# Altium schematic sheet PCB schematic for light switch.SchDoc
size A; SheetNumber: 1; SheetTotal: 1; SPICEModelCacheRGATOCWX: <root> / <DocumentId>RGATOCWX</DocumentId> / <CacheFrame Number="0"> / <Model Name="1n4007" Kind="MDL"> / <Text>*1N4007 MCE 8-16-95 / *1000V 1A Si GenPurpose Diode pkg:DIODE0.4 1,2 / .MODEL 1N4007 D(IS=2.55E-9 RS=0.042 N=1.75 TT=5.76E-6 CJO=1.85E-11 / + VJ=0.75 M=0.333 BV=1000 IBV=9.86E-5 )</Text> / </Model> / </CacheFrame> / </root>
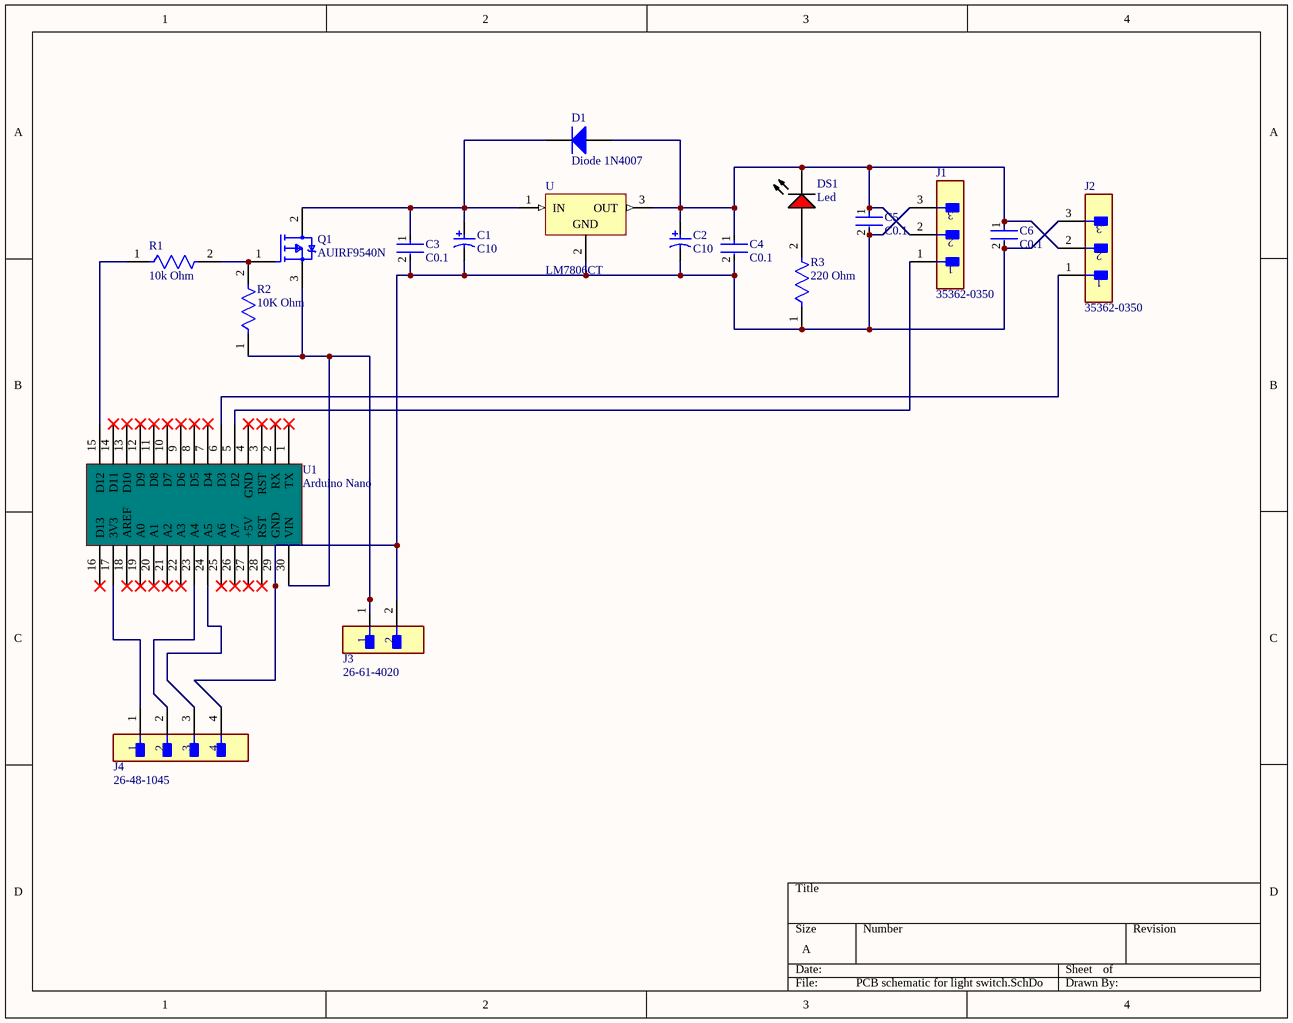
[diagram p0: PCB schematic for light switch.SchDoc]

## Parts
C1  C10  [CAPPR55-200-1100X500X1200]
C2  C10  [CAPPR55-200-1100X500X1200]
C3  C0.1  [FP-K15H5-MFG]
C4  C0.1  [FP-K15H5-MFG]
C5  C0.1  [FP-K15H5-MFG]
C6  C0.1  [FP-K15H5-MFG]
D1  Diode 1N4007  [DO-41]
DS1  Led  [AVAG-HLMP-3301-2]
J1  35362-0350  [FP-35362-0350-MFG]
J2  35362-0350  [FP-35362-0350-MFG]
J3  26-61-4020  [FP-26-61-4020-MFG]
J4  26-48-1045  [FP-26-48-1045-MFG]
Q1  AUIRF9540N  [FP-TO-220AB-MFG]
R1  10k Ohm  [FP-CF18-MFG]
R2  10K Ohm  [FP-CF18-MFG]
R3  220 Ohm  [FP-CF18-MFG]
U  LM7806CT  [FAIR-TO-220-3]
U1  Arduino Nano  [PCBComponent_1]

## Nets
NetC1_1: C1.1 C3.1 D1.2(K) Q1.2(D) U.1(IN)
NetC1_2: C1.2 C2.2 C3.2 C4.2 C5.2 C6.2 J1.3 J2.3 J3.2 J4.4 R3.1 U.2(GND) U1.29(GND)
NetC2_1: C2.1 C4.1 C5.1 C6.1 D1.1(A) DS1.1(K) J1.2 J2.2 U.3(OUT)
NetDS1_2: DS1.2(A) R3.2
NetJ1_1: J1.1 U1.5(D2)
NetJ2_1: J2.1 U1.6(D3)
NetJ3_1: J3.1 Q1.3(S) R2.1 U1.30(VIN)
NetJ4_1: J4.1 U1.17(3V3)
NetJ4_2: J4.2 U1.23(A4)
NetJ4_3: J4.3 U1.24(A5)
NetQ1_1: Q1.1(G) R1.2 R2.2
NetR1_1: R1.1 U1.15(D12)

Not connected (* = marked no-connect by the designer): U1 1(TX)* 2(RX)* 3(RST)* 4(GND)* 7(D4)* 8(D5)* 9(D6)* 10(D7)* 11(D8)* 12(D9)* 13(D10)* 14(D11)* 16(D13)* 18(AREF)* 19(A0)* 20(A1)* 21(A2)* 22(A3)* 25(A6)* 26(A7)* 27(+5V)* 28(RST)*

## Library data of the parts
C1 C2 = CMP-1665-00038-2: Aluminum Electrolytic Capacitor, 10 uF, +/- 20%, 50 V, -40 to 85 degC, 2-Pin THD, RoHS, Bulk; Manufacturer: Panasonic; Life (Hours): 2000Hour; Lead/Base Style: Straight; Dissipation Factor: 0.12%; Capacitance: 10uF; Leakage Current: 3uA; Dielectric Material: Aluminium; Lead Diameter: 0.5mm; Voltage Rating: 50V; Ripple Current: 65mA; Package Reference: CAPPR55-200-1100X500X1200; Height: 11mm; Diameter: 5mm; REACH SVHC: NoSVHC; Mount: ThroughHole; Packaging: Bulk; Manufacturer URL: http://www.panasonic.com/; Termination: Radial; Datasheet URL: https://industrial.panasonic.com/cdbs/www-data/pdf/RDF0000/ABA0000C1218.pdf; Lead Free: LeadFree; Height - Seated (Max): 0.472inch; Case/Package: Radial; Package Description: 2-Pin Radial Lead, Dia 5 mm, Height 12 mm; Tolerance: 20%; Datasheet Version: Rev. 05, 10/2016; Package Quantity: 200; Ripple Current (AC): 65mA; Min Operating Temperature: -40degC; RoHSCompliant: true; Number of Pins: 2; Max Operating Temperature: 85degC; Voltage: 50V; Lead Pitch: 2mm; Radiation Hardening: No; Voltage Rating (DC): 50V; Length: 11mm
C3-C6 = CMP-02417-000078-1: CAP CER 0.1UF 50V X7R RADIAL; Capacitance: 100nF; Tolerance: 10%; Dielectric Material: Ceramic; Lead Length: 30mm; Lead Diameter: 0.5mm; Lead/Base Style: Formed Leads; Diameter: 500um; Max Operating Temperature: 125°C; Case/Package: Dipped; Dielectric: X7R; Lead Free: Lead Free; Construction: RADIAL; Voltage: 50V; Thickness: 2.6mm; Min Operating Temperature: -55°C; Lead Pitch: 5mm; Height: 4mm; Radiation Hardening: No; Voltage Rating: 50V; Depth: 2.5mm; Voltage Rating (DC): 50V; Package Quantity: 1; Weight: 0.005644oz; Series: K; Mount: Through Hole; Termination: Radial; Height - Seated (Max): 0.257inch; Length: 4mm; Packaging: Tape and Reel; Width: 2.5mm; RoHS Compliant: Yes
D1 = Diode 1N4007: 1 Amp General Purpose Rectifier; Published: 8-Jun-2000; LatestRevisionDate: 17-Jul-2002; LatestRevisionNote: Re-released for DXP Platform.; DatasheetVersion: 1998; PackageVersion: Aug-1999; PackageReference: DO-41; Publisher: Altium Limited; PackageDescription: Diode, Axial; Body 5.2 x 2.7 mm (LxDia. max), Lead Dia. 0.86 mm (max); Code_JEDEC: DO-204-AL; ComponentLink1Description: Manufacturer Link; ComponentLink1URL: http://www.fairchildsemi.com/; ComponentLink2Description: Datasheet; ComponentLink2URL: http://www.fairchildsemi.com/ds/1N%2F1N4001.pdf
DS1 = CMP-2000-06411-1: T-1 3/4 (5 mm) Diffused LED Lamp, 1.9 V, -40 to 100 degC, 2-Pin THD, RoHS, Bulk; Manufacturer: Avago; Forward Current: 25mA; Forward Voltage: 2.4V; Peak Wavelength: 635nm; Shape Type: Circular; High Brightness: No; Main Category: StandardLED; Test Current (It): 10mA; Dominant Wave Length: 626nm; Number of  Elements: 1; Reverse Voltage: 5V; Chip Material: GaP; Product Height (mm): 9.19mm; Lens Type: ColoredDiffused; Viewing Angle: 60deg; Type: Uni-Color; Emitting Color: Red; Luminous Intensity: 5.4mcd; Power Dissipation: 85W; DELETED: Compliant; Product Depth (mm): 6.1mm; Package Description: 2-Pin Through Hole LED, Dia 5.85 mm; Mounting Technology: ThroughHole; Manufacturer URL: http://www.avagotech.com/; Package Type: T-13/4; Operating Temp Range: -40Cto100C; Datasheet URL: http://www.avagotech.com/docs/AV02-1558EN; Mounting: ThroughHole; Lens Dimensions: 5.08x5.08x8.3mm; Package Reference: HLMP-3301; Datasheet Version: 03/2015; Pin Count: 2; Packaging: TapeandReel; Operating Temperature Classification: Industrial; Lum Intensity: 5.4mcd; Rad Hardened: No; Product Length (mm): 6.1mm
J1 J2 = CMP-04776-000519-1: CONN HEADER VERT 3POS 2MM; Voltage Rating: 125V; Gender: Male; Contact Resistance: 20mR; Number of Positions: 3; Max Voltage Rating (DC): 125.125kV; Glow Wire Compliant: Non-compliant; Current Rating: 2A; Insulation Resistance: 1GR; Height: 2.3mm; Lead Pitch: 2mm; Number of Rows: 1; Packaging: Bulk; Radiation Hardening: No; Max Operating Temperature: 105°C; Lead Free: Lead Free; Contact Material: Brass; Housing Material: Nylon; Voltage Rating (AC): 125V; Depth: 2.3mm; Min Operating Temperature: -40°C; Package Quantity: 1000; Pitch: 2mm; Width: 10.3mm; Mount: Through Hole; Halogen Free: Low Halogen; Length: 14.7mm; Termination: Solder; Contact Plating: Tin; Color: Natural; Number of Circuits: 3; Series: SHERLOCK; Case/Package: 0350; Number of Contacts: 3; Voltage Rating (DC): 125V; Orientation: Vertical; Housing Color: Natural; Flammability Rating: UL94 V-0; Max Current Rating: 2A
J3 = CMP-00257-00277943-1: 26-61-4020 3.96mm (.156") Pitch KK® Solid Header, Vertical, Friction Lock, 2 Circuits, Gold (Au) Plating; NexarPartId: 277943; Manufacturer Lifecycle Status: ACTIVE; Number of Positions: 2; Contact Resistance: 6mΩ; Voltage Rating (DC): 250V; Glow Wire Compliant: Non-compliant; Max Current Rating: 7A; Insulation Resistance: 50GΩ; Gender: Male; Pitch: 3.96mm; Orientation: Right Angle, Vertical; Number of Circuits: 2; Length: 7.77mm; Depth: 10.01mm; Min Operating Temperature: 0°C; Mount: Through Hole; Lifecycle Status: Production; Lead Pitch: 3.96mm; Packaging: Bulk; Voltage Rating: 250V; Flammability Rating: UL94 V-0; Schedule B: 8536694040; Country of Origin: US; Contact Plating: Gold; Housing Color: Natural; Lead Free: Lead Free; Housing Material: Polyester; RoHS: Compliant; Color: Natural; Contact Material: Brass; REACH SVHC: Unknown; Number of Contacts: 2; Number of Rows: 1; Height: 14.73mm; Current Rating: 7A; Termination: Solder; Max Operating Temperature: 75°C; Max Voltage Rating (AC): 250V; Radiation Hardening: No
J4 = CMP-00257-00006898-1: 26-48-1045 KK 396 Breakaway Header Vertical Square Pin with Friction Lock 4 Circuits Tin (Sn) Plating; NexarPartId: 6898; Manufacturer Lifecycle Status: ACTIVE; Pitch: 3.96mm; Number of Contacts: 4; Voltage Rating (DC): 250V; Glow Wire Compliant: Non-compliant; Gender: Male; Approvals: CSA, TUV, UL; Current Rating: 7A; Contact Resistance: 10mΩ; Contact Plating: Tin; Color: Black; Schedule B: 8536694040; Termination: Solder; Contact Material: Brass; RoHS: Compliant; Number of Rows: 1; Orientation: Right Angle, Vertical; Min Operating Temperature: 0°C; Height: 15.31mm; Voltage Rating: 250V; Mount: Through Hole; Number of Positions: 4; Max Operating Temperature: 75°C; Radiation Hardening: No; Lifecycle Status: Production; Lead Free: Lead Free; Housing Material: Polyester; Flammability Rating: UL94 V-0; Lead Pitch: 3.96mm; Number of Circuits: 4; Housing Color: Black; Country of Origin: PR; Voltage Rating (AC): 250V
Q1 = CMP-00196-74197148-1: AUIRF9540N Automotive Q101 -100V Single P-Channel HEXFET Power MOSFET in a TO-220AB Package; Continuous Drain Current (ID): -23A; Max Junction Temperature (Tj): 175°C; Threshold Voltage: -2V; On-State Resistance: 117mΩ; Number of Elements: 1; Turn-Off Delay Time: 51ns; Turn-On Delay Time: 15ns; Rise Time: 67ns; Gate to Source Voltage (Vgs): 20V; Max Power Dissipation: 140W; Input Capacitance: 1.3nF; Width: 4.82mm; Drain to Source Breakdown Voltage: -100V; NexarPartId: 74197148; Package Quantity: 1000; Fall Time: 51ns; REACH SVHC: No SVHC; Number of Pins: 3; Max Operating Temperature: 175°C; Min Operating Temperature: -55°C; Length: 10.66mm; Lifecycle Status: Obsolete; RoHS: Compliant; Drain to Source Resistance: 117mΩ; Drain to Source Voltage (Vdss): -100V; Power Dissipation: 140W; Case/Package: TO-220AB; Height: 16.51mm; Radiation Hardening: No; Mount: Through Hole
R1-R3 = CMP-26528-000002-1: RES 10K OHM 1/8W 5% CF AXIAL; Manufacturer Part Number: CF18JT10K0; Manufacturer: Stackpole Electronics; Power Rating: 0.125W; Temperature Coefficient: 0-500ppm/°C; Resistance: 10kΩ; Voltage Rating: 250V; Value: 10kΩ; Temperature: -55°C to +155°C; Height: 2mm; Lead Free: Yes; Automotive: No; Device Class L2: Resistors; Package: CF18; Series: CF; ComponentLink2Description: Datasheet; Ipc Land Pattern Name: RESAD656W65L360D200; Temperature Range High: +155°C; RoHS: TRUE; Device Class L3: Through-Hole Resistors; Temperature Range Low: -55°C; Device Class L1: Passive Components; Category: Res; Octopart: https://octopart.com/cf18jt10k0-stackpole+electronics-19205642; Composition: Carbon Film; Digikey Description: RES 10K OHM 1/8W 5% CF AXIAL; ComponentLink2URL: http://www.seielect.com/Catalog/SEI-CF_CFM.pdf; Tolerance: 5%
U = CMP-2000-04938-1: Positive Voltage Regulator, 5 V, 1 A, -40 to 125 degC, 3-Pin TO-220, RoHS, Tube; Manufacturer: FairchildSemiconductor; Maximum Input Voltage: 35V; Maximum Quiescent Current: 8mA; Load Regulation: 100mV; Maximum Output Current: 2.2(Typ)A; Output Type: Fixed; Typical Dropout Voltage @ Current: 2@1AV; Rad Hard: No; Output Voltage: 5V; Accuracy: ±4%; Number of Outputs: 1; Category: LinearRegulator; Package Description: 3-Pin Through Hole Device, Body 10 x 4.5 mm, Pitch 2.54 mm; Packaging: Rail/Tube; Mounting: ThroughHole; Polarity: Positive; Manufacturer URL: https://www.fairchildsemi.com/; Line Regulation: 100mV; Datasheet Version: Aug-12; Datasheet URL: https://datasheet.ciiva.com/26904/lm7805ct-26904988.pdf; Package Reference: TO-220; Package URL: https://www.fairchildsemi.com/package-drawings/TO/TO220B03.pdf; Package: 3TO-220AB; Operating Temperature: -40to125degC; Type: Linear
U1 = Component_1